# Altium schematic sheet Barelang-FC Strategy.SchDoc
size A4
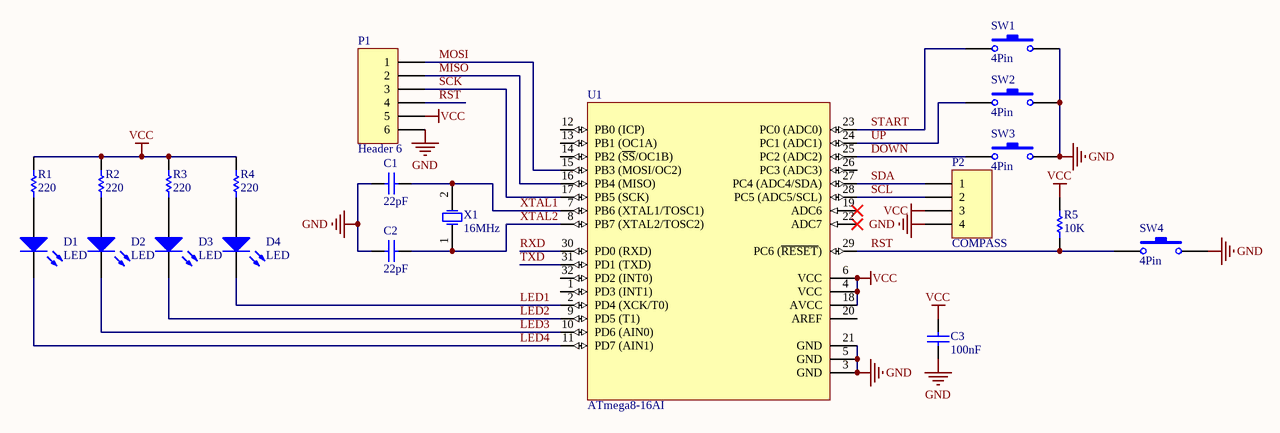
[diagram p0: Barelang-FC Strategy.SchDoc]

## Parts
C1  22pF  [C0805]
C2  22pF  [C0805]
C3  100nF  [C0805]
D1  LED  [CHIPLED_1206]
D2  LED  [CHIPLED_1206]
D3  LED  [CHIPLED_1206]
D4  LED  [CHIPLED_1206]
P1  Header 6  [HDR1X6]
P2  COMPASS  [HDR1X4]
R1  220  [R0805]
R2  220  [R0805]
R3  220  [R0805]
R4  220  [R0805]
R5  10K  [R0805]
SW1  4Pin  [TACTILE-PTH-12MM]
SW2  4Pin  [TACTILE-PTH-12MM]
SW3  4Pin  [TACTILE-PTH-12MM]
SW4  4Pin  [TACTILE-PTH-12MM]
U1  ATmega8-16AI  [32A_N]
X1  16MHz  [HC49US]

## Nets
GND: C1.1 C2.1 C3.1 P1.6 P2.4 SW1.2 SW2.2 SW3.2 SW4.2 U1.3(GND) U1.5(GND) U1.21(GND)
VCC: C3.2 P1.5 P2.3 R1.2 R2.2 R3.2 R4.2 R5.2 U1.4(VCC) U1.6(VCC) U1.18(AVCC)
DOWN: SW3.1 U1.25(PC2_(ADC2))
LED1: D4.2(K) U1.2(PD4_(XCK/T0))
LED2: D3.2(K) U1.9(PD5_(T1))
LED3: D2.2(K) U1.10(PD6_(AIN0))
LED4: D1.2(K) U1.11(PD7_(AIN1))
MISO: P1.2 U1.16(PB4_(MISO))
MOSI: P1.1 U1.15(PB3_(MOSI/OC2))
RST: P1.4 R5.1 SW4.1 U1.29(PC6_(~{RESET}))
RXD: U1.30(PD0_(RXD))
SCK: P1.3 U1.17(PB5_(SCK))
SCL: P2.2 U1.28(PC5_(ADC5/SCL))
SDA: P2.1 U1.27(PC4_(ADC4/SDA))
START: SW1.1 U1.23(PC0_(ADC0))
TXD: U1.31(PD1_(TXD))
UP: SW2.1 U1.24(PC1_(ADC1))
XTAL1: C1.2 U1.7(PB6_(XTAL1/TOSC1)) X1.2(OSC2)
XTAL2: C2.2 U1.8(PB7_(XTAL2/TOSC2)) X1.1(OSC1)
NetD1_1: D1.1(A) R1.1
NetD2_1: D2.1(A) R2.1
NetD3_1: D3.1(A) R3.1
NetD4_1: D4.1(A) R4.1

Not connected (* = marked no-connect by the designer): U1 1(PD3_(INT1)) 12(PB0_(ICP)) 13(PB1_(OC1A)) 14(PB2_(~{SS}/OC1B)) 19(ADC6)* 20(AREF) 22(ADC7)* 26(PC3_(ADC3)) 32(PD2_(INT0))

## Notes on the sheet
- Title
- Size:
- Date:
- A4
- Drawn By:
- Time:
- Sheet
- of
- toko-Embedded
- www.toko-embedded.com
- Hp : 085765221924
- Batam, Kepulauan Riau
- Indonesia
- File:

## Library data of the parts
C1-C3 = Capacitor: Type: Ceramic; Category: Capacitor; Price: *
  C1 C2: Value: 22pF
  C3: Value: 100nF
D1-D4 = LED: Type: 3mm; Value: Red; Category: LED; Price: 200; Link: http://www.sfe-electronics.com/product.php?category=13&product_id=46
P1 = Header 6: Header, 6-Pin; LatestRevisionDate: 17-Jul-2002; LatestRevisionNote: Re-released for DXP Platform.; Publisher: Altium Limited
P2 = Header 4: Header, 4-Pin; LatestRevisionDate: 17-Jul-2002; LatestRevisionNote: Re-released for DXP Platform.; Publisher: Altium Limited
R1-R5 = Resistor: Category: Resistor; Type: 1/4W - 5%; Price: 30; Link: http://www.sfe-electronics.com/product.php?category=6&product_id=79
  R1-R4: Value: 220
  R5: Value: 10K
SW1-SW4 = Switch Pushbutton: Value: 4Pin; Category: Switch; Type: Pushbutton; Price: 800; Link: http://www.sfe-electronics.com/product.php?category=52&product_id=182
U1 = ATmega8-16AI: 8-Bit AVR Microcontroller with 8K Bytes of In-System Programmable Flash Memory; Published: 17-Sep-2003; LatestRevisionDate: 16-Oct-2006; LatestRevisionNote: IPC-7351 Footprint Added.; DatasheetVersion: 2486H-AVR-09/02; PackageVersion: revB, Oct-2001; PackageReference: 32A; Publisher: Altium Limited; PackageDescription: 32-Lead, 7x7x1.0 mm Body, 0.8mm Lead Pitch, Thin Profile Plastic Quad Flat Package (TQFP); Supplier 1: Digi-Key; Supplier Part Number 1: ATMEGA8-16AI-ND; Supplier 2: Mouser; Supplier Part Number 2: 556-ATMEGA8-16AI; Code_JEDEC: MS-026-ABA; ComponentLink1Description: Datasheet; ComponentLink1URL: http://www.atmel.com/dyn/resources/prod_documents/doc2486.pdf; ComponentLink2Description: Atmel.com Home; ComponentLink2URL: http://www.atmel.com
X1 = Crystal: Value: 16MHz; Category: Crystal; Type: *; Price: *